# EAGLE design schema (EAGLE 5.11)
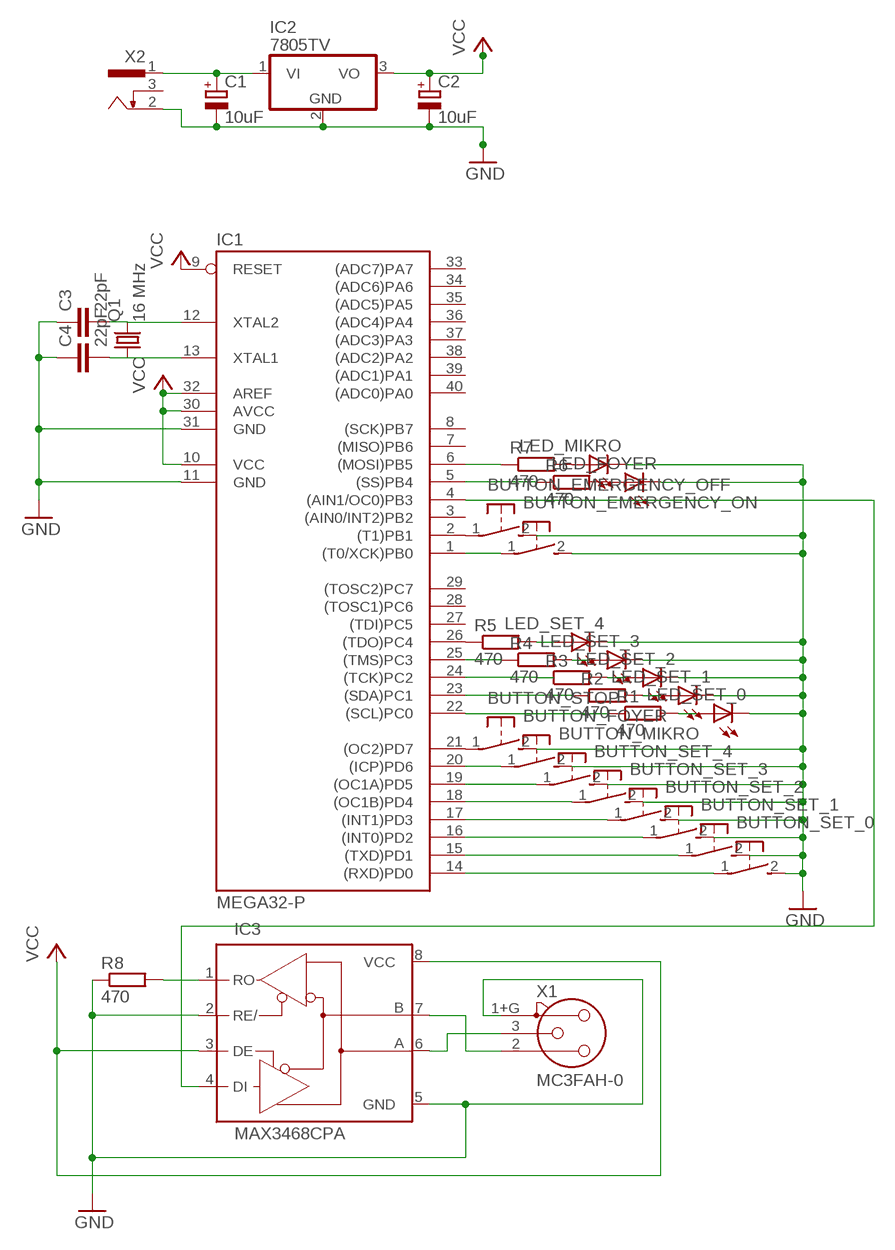
[diagram p0: schematic, sheet 1]

## Parts
BUTTON_EMERGENCY_OFF  31-XX  [B3F-31XX]
BUTTON_EMERGENCY_ON  31-XX  [B3F-31XX]
BUTTON_FOYER  31-XX  [B3F-31XX]
BUTTON_MIKRO  31-XX  [B3F-31XX]
BUTTON_SET_0  31-XX  [B3F-31XX]
BUTTON_SET_1  31-XX  [B3F-31XX]
BUTTON_SET_2  31-XX  [B3F-31XX]
BUTTON_SET_3  31-XX  [B3F-31XX]
BUTTON_SET_4  31-XX  [B3F-31XX]
BUTTON_STOP  31-XX  [B3F-31XX]
C1  10uF  CPOL-EUB45181B  [B45181B]
C2  10uF  CPOL-EUB45181B  [B45181B]
C3  22pF  C-EU025-025X050  [C025-025X050]
C4  22pF  C-EU025-025X050  [C025-025X050]
IC1  MEGA32-P  [DIL40]
IC2  7805TV  [TO220V]
IC3  MAX3468CPA  [DIL08]
LED_FOYER  LED5MM  [LED5MM]
LED_MIKRO  LED5MM  [LED5MM]
LED_SET_0  LED5MM  [LED5MM]
LED_SET_1  LED5MM  [LED5MM]
LED_SET_2  LED5MM  [LED5MM]
LED_SET_3  LED5MM  [LED5MM]
LED_SET_4  LED5MM  [LED5MM]
Q1  16 MHz  CRYSTALHC18U-V  [HC18U-V]
R1  470  R-EU_0207/10  [0207/10]
R2  470  R-EU_0207/10  [0207/10]
R3  470  R-EU_0207/10  [0207/10]
R4  470  R-EU_0207/10  [0207/10]
R5  470  R-EU_0207/10  [0207/10]
R6  470  R-EU_0207/10  [0207/10]
R7  470  R-EU_0207/10  [0207/10]
R8  470  R-EU_0207/10  [0207/10]
X1  MC3FAH-0  [NC3FAH1-0]
X2  733989-5  [733989-5]

## Nets
GND: BUTTON_EMERGENCY_OFF.2(S) BUTTON_EMERGENCY_ON.2(S) BUTTON_FOYER.2(S) BUTTON_MIKRO.2(S) BUTTON_SET_0.2(S) BUTTON_SET_1.2(S) BUTTON_SET_2.2(S) BUTTON_SET_3.2(S) BUTTON_SET_4.2(S) BUTTON_STOP.2(S) C1.- C2.- C3.1 C4.1 IC1.11(GND) IC1.31(GND) IC2.2(GND) IC3.2(RE/) IC3.5(GND) LED_FOYER.K(C) LED_MIKRO.K(C) LED_SET_0.K(C) LED_SET_1.K(C) LED_SET_2.K(C) LED_SET_3.K(C) LED_SET_4.K(C) R8.1 X1.1+G X2.2
N$1: IC1.4((AIN1/OC0)PB3) IC3.4(DI)
N$2: C3.2 IC1.12(XTAL2) Q1.2
N$3: C4.2 IC1.13(XTAL1) Q1.1
N$4: BUTTON_SET_3.1(P) IC1.17((INT1)PD3)
N$5: BUTTON_SET_0.1(P) IC1.14((RXD)PD0)
N$6: BUTTON_SET_1.1(P) IC1.15((TXD)PD1)
N$7: BUTTON_SET_2.1(P) IC1.16((INT0)PD2)
N$8: BUTTON_SET_4.1(P) IC1.18((OC1B)PD4)
N$9: BUTTON_MIKRO.1(P) IC1.19((OC1A)PD5)
N$10: BUTTON_FOYER.1(P) IC1.20((ICP)PD6)
N$11: BUTTON_STOP.1(P) IC1.21((OC2)PD7)
N$12: BUTTON_EMERGENCY_ON.1(P) IC1.1((T0/XCK)PB0)
N$13: BUTTON_EMERGENCY_OFF.1(P) IC1.2((T1)PB1)
N$14: IC3.1(RO) R8.2
N$15: LED_MIKRO.A R7.2
N$16: LED_FOYER.A R6.2
N$17: IC3.6(A) X1.3
N$18: IC3.7(B) X1.2
N$19: LED_SET_4.A R5.2
N$20: LED_SET_3.A R4.2
N$21: LED_SET_2.A R3.2
N$22: LED_SET_1.A R2.2
N$23: LED_SET_0.A R1.2
N$24: C1.+ IC2.1(VI) X2.1
N$25: IC1.23((SDA)PC1) R2.1
N$26: IC1.24((TCK)PC2) R3.1
N$27: IC1.25((TMS)PC3) R4.1
N$28: IC1.26((TDO)PC4) R5.1
N$29: IC1.5((SS)PB4) R6.1
N$30: IC1.6((MOSI)PB5) R7.1
N$31: IC1.22((SCL)PC0) R1.1
VCC: C2.+ IC1.9(RESET) IC1.10(VCC) IC1.30(AVCC) IC1.32(AREF) IC2.3(VO) IC3.3(DE) IC3.8(VCC)
Unconnected: IC1.3((AIN0/INT2)PB2) IC1.7((MISO)PB6) IC1.8((SCK)PB7) IC1.27((TDI)PC5) IC1.28((TOSC1)PC6) IC1.29((TOSC2)PC7) IC1.33((ADC7)PA7) IC1.34((ADC6)PA6) IC1.35((ADC5)PA5) IC1.36((ADC4)PA4) IC1.37((ADC3)PA3) IC1.38((ADC2)PA2) IC1.39((ADC1)PA1) IC1.40((ADC0)PA0) X2.3

## Library data of the parts
BUTTON_EMERGENCY_OFF BUTTON_EMERGENCY_ON BUTTON_FOYER BUTTON_MIKRO BUTTON_SET_0 BUTTON_SET_1-BUTTON_SET_4 BUTTON_STOP = switch-omron:31-XX: OMRON SWITCH; MPN: B3F-3100; OC_FARNELL: 959704; OC_NEWARK: 36M3582
C1 C2 = rcl:CPOL-EU: POLARIZED CAPACITOR, European symbol
C3 C4 = rcl:C-EU: CAPACITOR, European symbol
IC1 = atmel:MEGA32-P: MICROCONTROLLER 32 Kbytes FLASH 2 Kbytes SRAM 1 Kbytes EEPROM USART 8-channel 10 bit ADC Source: www.atmel.com .. doc2503.pdf; MPN: ATMEGA32-16PU; OC_FARNELL: 1661729; OC_NEWARK: 51P1794
IC2 = linear:78*: Positive VOLTAGE REGULATOR Source: http://cache.national.com/ds/LM/LM78L05.pdf http://www.fairchildsemi.com/ds/LM/LM7805.pdf
IC3 = maxim:MAX34*: +5V, Fail-Safe, 40Mbps, Profibus RS-485/RS-422 Transceivers Source: MAX3465-MAX3469.pdf; OC_FARNELL: unknown; OC_NEWARK: unknown
LED_FOYER LED_MIKRO LED_SET_0 LED_SET_1-LED_SET_4 = led:LED: LED OSRAM: - CHIPLED LG R971, LG N971, LY N971, LG Q971, LY Q971, LO R971, LY R971 LH N974, LH R974 LS Q976, LO Q976, LY Q976 LO Q996 - Hyper CHIPLED LW Q18S LB Q993, LB Q99A, LB R99A - SideLED LS A670, LO A670, LY A670, LG A670, LP A670 LB A673, LV A673, LT A673, LW A673 LH A674 LY A675 LS A676, LA A676, LO A676, LY A676, LW A676 LS A679, LY A679, LG A679 - Hyper Micro SIDELED® LS Y876, LA Y876, LO Y876, LY Y876 LT Y87S - SmartLED LW L88C, LW L88S LB L89C, LB L89S, LG L890 LS L89K, LO L89K, LY L89K LS L896, LA L896, LO L896, LY L896 - TOPLED LS T670, LO T670, LY T670, LG T670, LP T670 LSG T670, LSP T670, LSY T670, LOP T670, LYG T670 LG T671, LOG T671, LSG T671 LB T673, LV T673, LT T673, LW T673 LH T674 LS T676, LA T676, LO T676, LY T676, LB T676, LH T676, LSB T676, LW T676 LB T67C, LV T67C, LT T67C, LS T67K, LO T67K, LY T67K, LW E67C LS E67B, LA E67B, LO E67B, LY E67B, LB E67C, LV E67C, LT E67C LW T67C LS T679, LY T679, LG T679 LS T770, LO T770, LY T770, LG T770, LP T770 LB T773, LV T773, LT T773, LW T773 LH T774 LS E675, LA E675, LY E675, LS T675 LS T776, LA T776, LO T776, LY T776, LB T776 LHGB T686 LT T68C, LB T68C - Hyper Mini TOPLED® LB M676 - Mini TOPLED Santana® LG M470 LS M47K, LO M47K, LY M47K Source: http://www.osram.convergy.de LUXEON: - LUMILED® LXK2-PW12-R00, LXK2-PW12-S00, LXK2-PW14-U00, LXK2-PW14-V00 LXK2-PM12-R00, LXK2-PM12-S00, LXK2-PM14-U00 LXK2-PE12-Q00, LXK2-PE12-R00, LXK2-PE12-S00, LXK2-PE14-T00, LXK2-PE14-U00 LXK2-PB12-K00, LXK2-PB12-L00, LXK2-PB12-M00, LXK2-PB14-N00, LXK2-PB14-P00, LXK2-PB14-Q00 LXK2-PR12-L00, LXK2-PR12-M00, LXK2-PR14-Q00, LXK2-PR14-R00 LXK2-PD12-Q00, LXK2-PD12-R00, LXK2-PD12-S00 LXK2-PH12-R00, LXK2-PH12-S00 LXK2-PL12-P00, LXK2-PL12-Q00, LXK2-PL12-R00 Source: www.luxeon.com KINGBRIGHT: KA-3528ASYC Source: www.kingbright.com
Q1 = crystal:CRYSTAL: CRYSTAL; OC_FARNELL: unknown; OC_NEWARK: unknown
R1-R8 = rcl:R-EU_: RESISTOR, European symbol
X1 = con-neutrik_ag:MC3?: Neutrik Audio Connector XLR SERIES Stereo 1/4" jack Source: www.neutrik.com/; OC_FARNELL: unknown; OC_NEWARK: unknown
X2 = con-conrad:73398?: FEMALE PRINT CONNECTOR Niedervolt-Steckverbinder Distributor Conrad

## Board
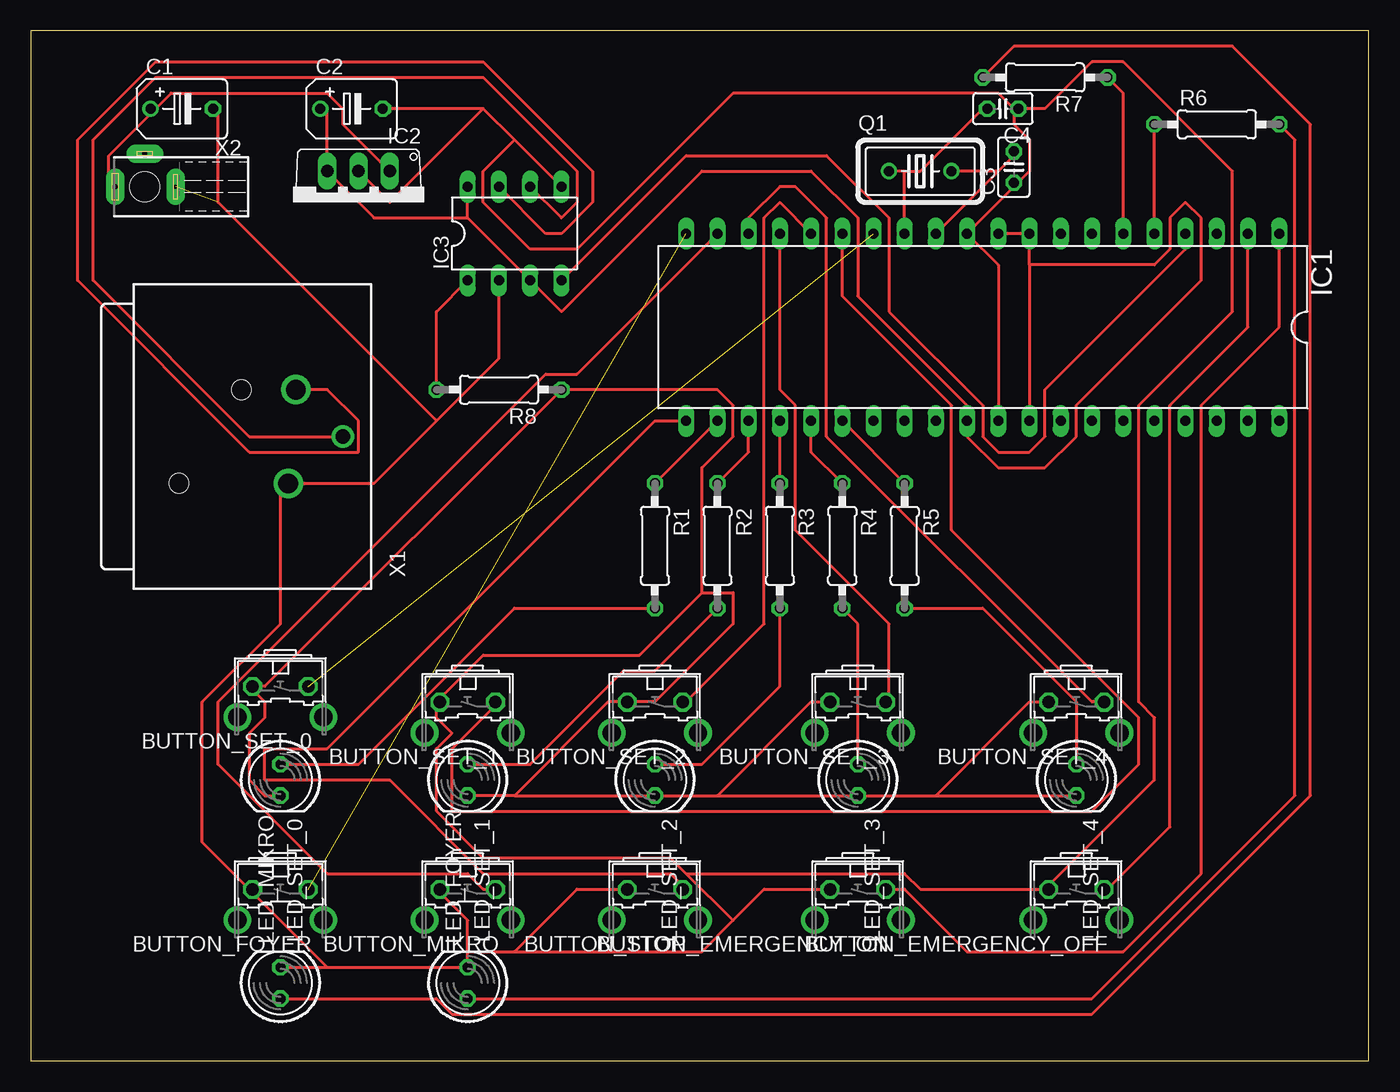
[diagram p1: board, top side]

Size 108.89 x 83.81 mm. Coordinates in mm from the lower left corner, seen from the top.
Outline: 0,0 108.89,0 108.89,83.81 0,83.81 0,0
Copper layers (1*16): Top 0.035mm / dielectric 1.5mm / Bottom 0.035mm
Design rules "default": minimum track width 10mil, minimum drill 24mil, track to track 8mil, track to pad 8mil, pad to pad 8mil, via to via 8mil, smd to smd 8mil, copper to edge 40mil, drill to drill 8mil, minimum pad ring 10mil, minimum via ring 8mil, stop-mask expansion 4mil, vias tented up to drill 0mil, thermal gap 10mil

### Footprints (pad centres in the part's own frame; a part is rotated, then mirrored left to right if it is on the bottom)
B3F-31XX = drill 1.016 octagon: 1 -2.261,-1.245; 2 2.261,-1.245 | drill 1.499 pad 2.159 round: 3 -3.505,1.245; 4 3.505,1.245
B45181B = drill 0.813 round: + -2.54,0 | drill 0.813 octagon: - 2.54,0
C025-025X050 = drill 0.813 octagon: 1 -1.27,0; 2 1.27,0
DIL40 = drill 0.813 long: 1 -24.13,-7.62; 2 -21.59,-7.62; 3 -19.05,-7.62; 4 -16.51,-7.62; 5 -13.97,-7.62; 6 -11.43,-7.62; 7 -8.89,-7.62; 8 -6.35,-7.62; 9 -3.81,-7.62; 10 -1.27,-7.62; 11 1.27,-7.62; 12 3.81,-7.62; 13 6.35,-7.62; 14 8.89,-7.62; 15 11.43,-7.62; 16 13.97,-7.62; 17 16.51,-7.62; 18 19.05,-7.62; 19 21.59,-7.62; 20 24.13,-7.62; 21 24.13,7.62; 22 21.59,7.62; 23 19.05,7.62; 24 16.51,7.62; 25 13.97,7.62; 26 11.43,7.62; 27 8.89,7.62; 28 6.35,7.62; 29 3.81,7.62; 30 1.27,7.62; 31 -1.27,7.62; 32 -3.81,7.62; 33 -6.35,7.62; 34 -8.89,7.62; 35 -11.43,7.62; 36 -13.97,7.62; 37 -16.51,7.62; 38 -19.05,7.62; 39 -21.59,7.62; 40 -24.13,7.62
TO220V = drill 1.016 long: 1 -2.54,-2.54; 2 0,-2.54; 3 2.54,-2.54
DIL08 = drill 0.813 long: 1 -3.81,-3.81; 2 -1.27,-3.81; 3 1.27,-3.81; 4 3.81,-3.81; 5 3.81,3.81; 6 1.27,3.81; 7 -1.27,3.81; 8 -3.81,3.81
LED5MM = drill 0.813 octagon: A -1.27,0; K 1.27,0
HC18U-V = drill 0.813 round: 1 -2.54,0; 2 2.54,0
0207/10 = drill 0.813 octagon: 1 -5.08,0; 2 5.08,0
NC3FAH1-0 = drill 1.6 round: 1+G -3.81,0.635; 2 3.81,0 | drill 1.2 round: 3 0,-3.815 | hole 1.6: -3.81,9.525; 3.81,4.445
733989-5 = drill 0.4 pad 1.5 long: 1 0,5.82; 3 2.7,3.42 | drill 0.3 pad 1.5 long: 2 0,0.92 | hole 2.4: 0,3.42

### Placement (x,y rotation side)
BUTTON_EMERGENCY_OFF  85.09,12.7 180 top
BUTTON_EMERGENCY_ON  67.31,12.7 180 top
BUTTON_FOYER  20.32,12.7 180 top
BUTTON_MIKRO  35.56,12.7 180 top
BUTTON_SET_0  20.32,29.21 180 top
BUTTON_SET_1  35.56,27.94 180 top
BUTTON_SET_2  50.8,27.94 180 top
BUTTON_SET_3  67.31,27.94 180 top
BUTTON_SET_4  85.09,27.94 180 top
BUTTON_STOP  50.8,12.7 180 top
C1  12.29,77.47 0 top
C2  26.11,77.47 0 top
C3  80.01,72.72 90 top
C4  79.11,77.47 180 top
IC1  77.47,59.69 180 top
IC2  26.67,69.85 180 top
IC3  39.37,67.31 0 top
LED_FOYER  35.56,6.35 90 top
LED_MIKRO  20.32,6.35 90 top
LED_SET_0  20.32,22.86 270 top
LED_SET_1  35.56,22.86 270 top
LED_SET_2  50.8,22.86 270 top
LED_SET_3  67.31,22.86 270 top
LED_SET_4  85.09,22.86 270 top
Q1  72.39,72.39 0 top
R1  50.8,41.91 270 top
R2  55.88,41.91 270 top
R3  60.96,41.91 270 top
R4  66.04,41.91 270 top
R5  71.12,41.91 270 top
R6  96.52,76.2 0 top
R7  82.55,80.01 180 top
R8  38.1,54.61 180 top
X1  21.59,50.8 90 top
X2  12.7,71.12 90 top

### Tracks (layer width: path | path; a pad name or v marks a point on that pad's centre or on a via)
GND  (1 unrouted)
  Top 0.254: 39.37,74.93 IC3.5 | 39.37,74.93 36.83,77.47 | 36.83,77.47 C2.- | IC2.2 29.21,69.85 36.83,77.47 | 80.01,71.12 IC1.11 78.74,64.77 IC1.31 | 80.01,77.47 80.01,76.2 81.28,74.93 81.28,72.39 80.01,71.12 | 80.01,71.12 C3.1 | 39.37,74.93 36.83,72.39 36.83,69.85 40.64,66.04 44.45,66.04 57.15,78.74 78.74,78.74 80.01,77.47 | LED_SET_0.K 19.05,21.59 17.78,22.86 17.78,26.67 19.05,27.94 19.05,29.21 17.78,30.48 | 17.78,30.48 19.05,30.48 R8.1 55.88,54.61 57.15,53.34 57.15,50.8 54.61,48.26 54.61,38.1 | 17.78,30.48 BUTTON_SET_0.2 | 39.37,21.59 LED_SET_2.K 55.88,21.59 | 39.37,21.59 LED_SET_1.K | 55.88,21.59 LED_SET_3.K 73.66,21.59 | 73.66,21.59 LED_SET_4.K | 48.26,29.21 46.99,29.21 39.37,21.59 | 55.88,21.59 63.5,29.21 64.77,29.21 BUTTON_SET_3.2 | 73.66,21.59 81.28,29.21 82.55,29.21 BUTTON_SET_4.2 | IC3.2 38.1,57.15 33.02,52.07 | 33.02,52.07 27.94,46.99 X1.1+G 20.32,46.99 20.32,35.56 13.97,29.21 13.97,17.78 17.78,13.97 | 33.02,52.07 15.24,69.85 15.24,77.47 C1.- | 24.13,7.62 LED_FOYER.K 35.56,8.89 | LED_MIKRO.K 24.13,7.62 | 24.13,7.62 17.78,13.97 | 35.56,8.89 35.56,11.43 33.02,13.97 BUTTON_MIKRO.2 | 39.37,8.89 44.45,13.97 48.26,13.97 BUTTON_STOP.2 | 35.56,8.89 39.37,8.89 | 57.15,11.43 54.61,8.89 39.37,8.89 | 57.15,11.43 59.69,13.97 64.77,13.97 BUTTON_EMERGENCY_ON.2 | 33.02,29.21 33.02,27.94 34.29,26.67 33.02,25.4 33.02,20.32 36.83,16.51 52.07,16.51 53.34,15.24 | 57.15,11.43 53.34,15.24 | 82.55,13.97 72.39,13.97 71.12,15.24 53.34,15.24 | 17.78,13.97 BUTTON_FOYER.2 | 48.26,29.21 50.8,29.21 57.15,35.56 57.15,38.1 54.61,38.1 | 54.61,38.1 49.53,33.02 36.83,33.02 33.02,29.21 | 48.26,29.21 BUTTON_SET_2.2 | 33.02,29.21 BUTTON_SET_1.2
  Top 0.254: 82.55,13.97 91.44,22.86 91.44,27.94 90.17,29.21 90.17,53.34 97.79,60.96 97.79,72.39 88.9,81.28 86.36,81.28 82.55,77.47 C4.1 80.01,77.47 | 82.55,13.97 BUTTON_EMERGENCY_OFF.2
N$1
  Top 0.254: IC3.4 53.34,73.66 64.77,73.66 69.85,68.58 69.85,60.96 77.47,53.34 77.47,50.8 78.74,49.53 81.28,49.53 82.55,50.8 82.55,54.61 93.98,66.04 IC1.4
N$2
  Top 0.254: 78.74,72.39 80.01,73.66 C3.2 | IC1.12 78.74,72.39 | 78.74,72.39 Q1.2
N$3
  Top 0.254: 71.12,72.39 72.39,72.39 77.47,77.47 C4.2 | 71.12,72.39 Q1.1 | IC1.13 71.12,72.39
N$4
  Top 0.254: IC1.17 60.96,54.61 62.23,53.34 62.23,43.18 69.85,35.56 69.85,29.21 BUTTON_SET_3.1
N$5  (1 unrouted)
N$6
  Top 0.254: IC1.15 66.04,62.23 74.93,53.34 74.93,43.18 90.17,27.94 90.17,24.13 86.36,20.32 34.29,20.32 34.29,25.4 38.1,29.21 BUTTON_SET_1.1
N$7
  Top 0.254: IC1.16 60.96,69.85 59.69,68.58 59.69,35.56 53.34,29.21 BUTTON_SET_2.1
N$8
  Top 0.254: IC1.18 58.42,68.58 60.96,71.12 62.23,71.12 64.77,68.58 64.77,50.8 86.36,29.21 87.63,29.21 BUTTON_SET_4.1
N$9
  Top 0.254: IC1.19 44.45,55.88 41.91,55.88 15.24,29.21 15.24,24.13 24.13,15.24 35.56,15.24 36.83,13.97 38.1,13.97 BUTTON_MIKRO.1
N$10  (1 unrouted)
N$11
  Top 0.254: IC1.21 50.8,52.07 24.13,25.4 19.05,25.4 19.05,22.86 29.21,22.86 36.83,15.24 52.07,15.24 53.34,13.97 BUTTON_STOP.1
N$12
  Top 0.254: IC1.1 101.6,59.69 95.25,53.34 95.25,15.24 88.9,8.89 76.2,8.89 71.12,13.97 69.85,13.97 BUTTON_EMERGENCY_ON.1
N$13
  Top 0.254: IC1.2 99.06,59.69 92.71,53.34 92.71,19.05 87.63,13.97 BUTTON_EMERGENCY_OFF.1
N$14
  Top 0.254: R8.2 33.02,60.96 IC3.1
N$15
  Top 0.254: LED_MIKRO.A 33.02,5.08 34.29,3.81 86.36,3.81 104.14,21.59 104.14,76.2 97.79,82.55 80.01,82.55 R7.2
N$16
  Top 0.254: LED_FOYER.A 86.36,5.08 102.87,21.59 102.87,74.93 R6.2
N$17
  Top 0.254: IC3.6 43.18,68.58 44.45,69.85 44.45,72.39 36.83,80.01 10.16,80.01 5.08,74.93 5.08,63.5 17.78,50.8 X1.3
N$18
  Top 0.254: IC3.7 41.91,67.31 43.18,67.31 45.72,69.85 45.72,72.39 36.83,81.28 10.16,81.28 3.81,74.93 3.81,63.5 17.78,49.53 26.67,49.53 26.67,52.07 24.13,54.61 X1.2
N$19
  Top 0.254: R5.2 77.47,36.83 85.09,29.21 LED_SET_4.A
N$20
  Top 0.254: LED_SET_3.A 67.31,35.56 R4.2
N$21
  Top 0.254: LED_SET_2.A 54.61,24.13 60.96,30.48 R3.2
N$22
  Top 0.254: LED_SET_1.A 40.64,24.13 48.26,31.75 50.8,31.75 R2.2
N$23
  Top 0.254: LED_SET_0.A 26.67,24.13 39.37,36.83 R1.2
N$24
  Top 0.254: 10.16,77.47 6.35,73.66 6.35,71.12 X2.1 | IC2.1 25.4,76.2 25.4,77.47 24.13,78.74 11.43,78.74 10.16,77.47 | 10.16,77.47 C1.+
N$25
  Top 0.254: R2.1 58.42,49.53 IC1.23
N$26
  Top 0.254: R3.1 IC1.24
N$27
  Top 0.254: IC1.25 63.5,49.53 R4.1
N$28
  Top 0.254: R5.1 IC1.26
N$29
  Top 0.254: IC1.5 R6.1
N$30
  Top 0.254: IC1.6 88.9,78.74 R7.1
N$31
  Top 0.254: R1.1 IC1.22
VCC
  Top 0.254: 81.28,64.77 IC1.9 IC1.10 | 81.28,64.77 IC1.32 | C2.+ 24.13,77.47 IC2.3 27.94,68.58 35.56,68.58 | 35.56,68.58 IC3.8 | 35.56,68.58 IC3.3 43.18,60.96 54.61,72.39 63.5,72.39 67.31,68.58 67.31,62.23 76.2,53.34 IC1.30 76.2,50.8 78.74,48.26 82.55,48.26 85.09,50.8 85.09,53.34 95.25,63.5 95.25,68.58 93.98,69.85 92.71,68.58 92.71,66.04 91.44,64.77 81.28,64.77